# Altium schematic sheet charge_drv.SchDoc
size A2
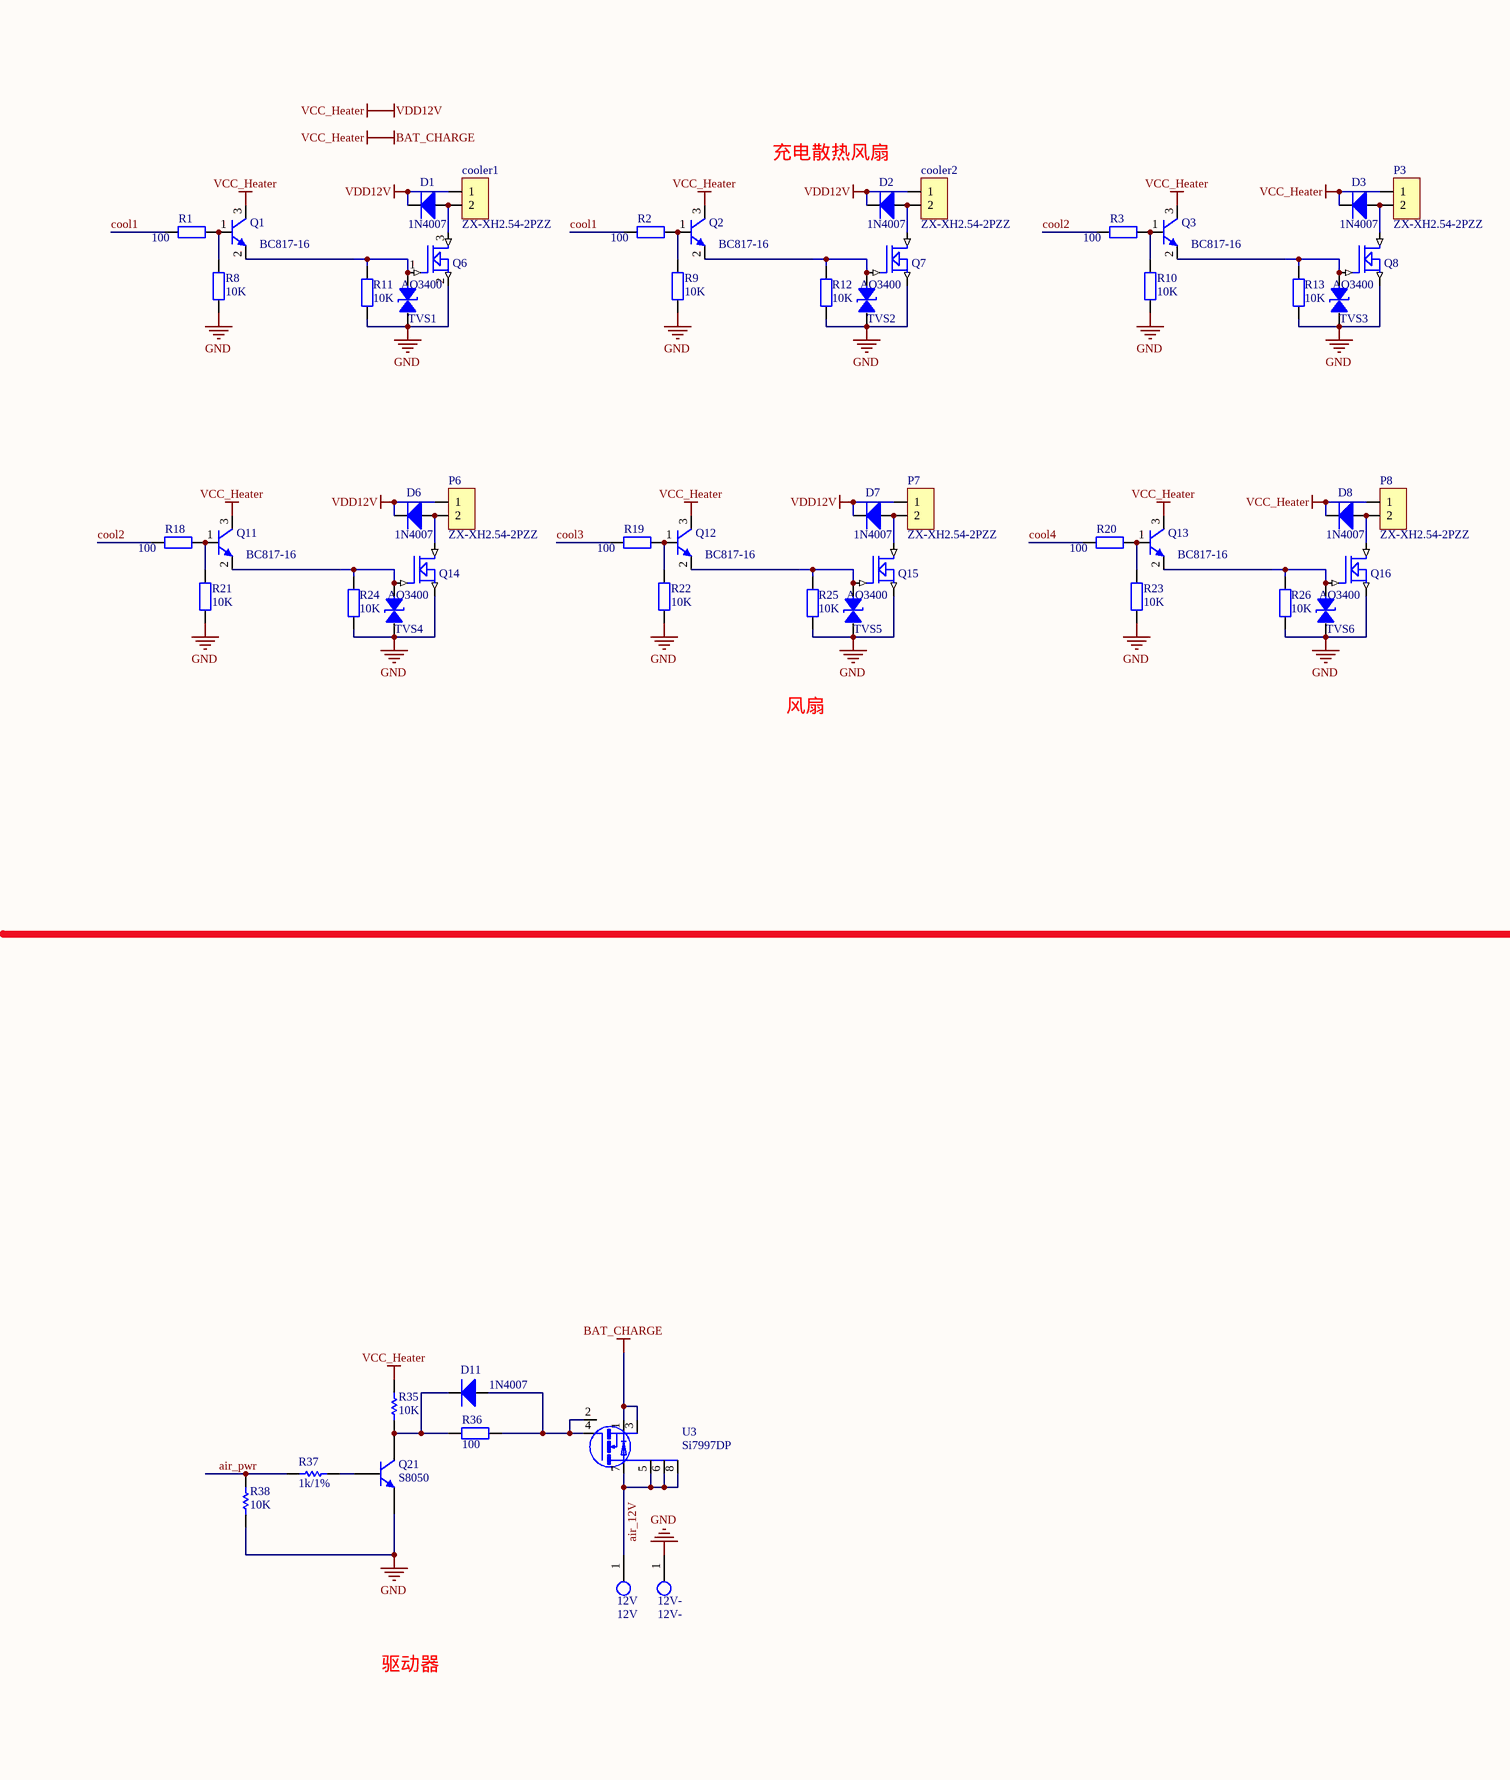
[diagram p0: charge_drv.SchDoc, left]
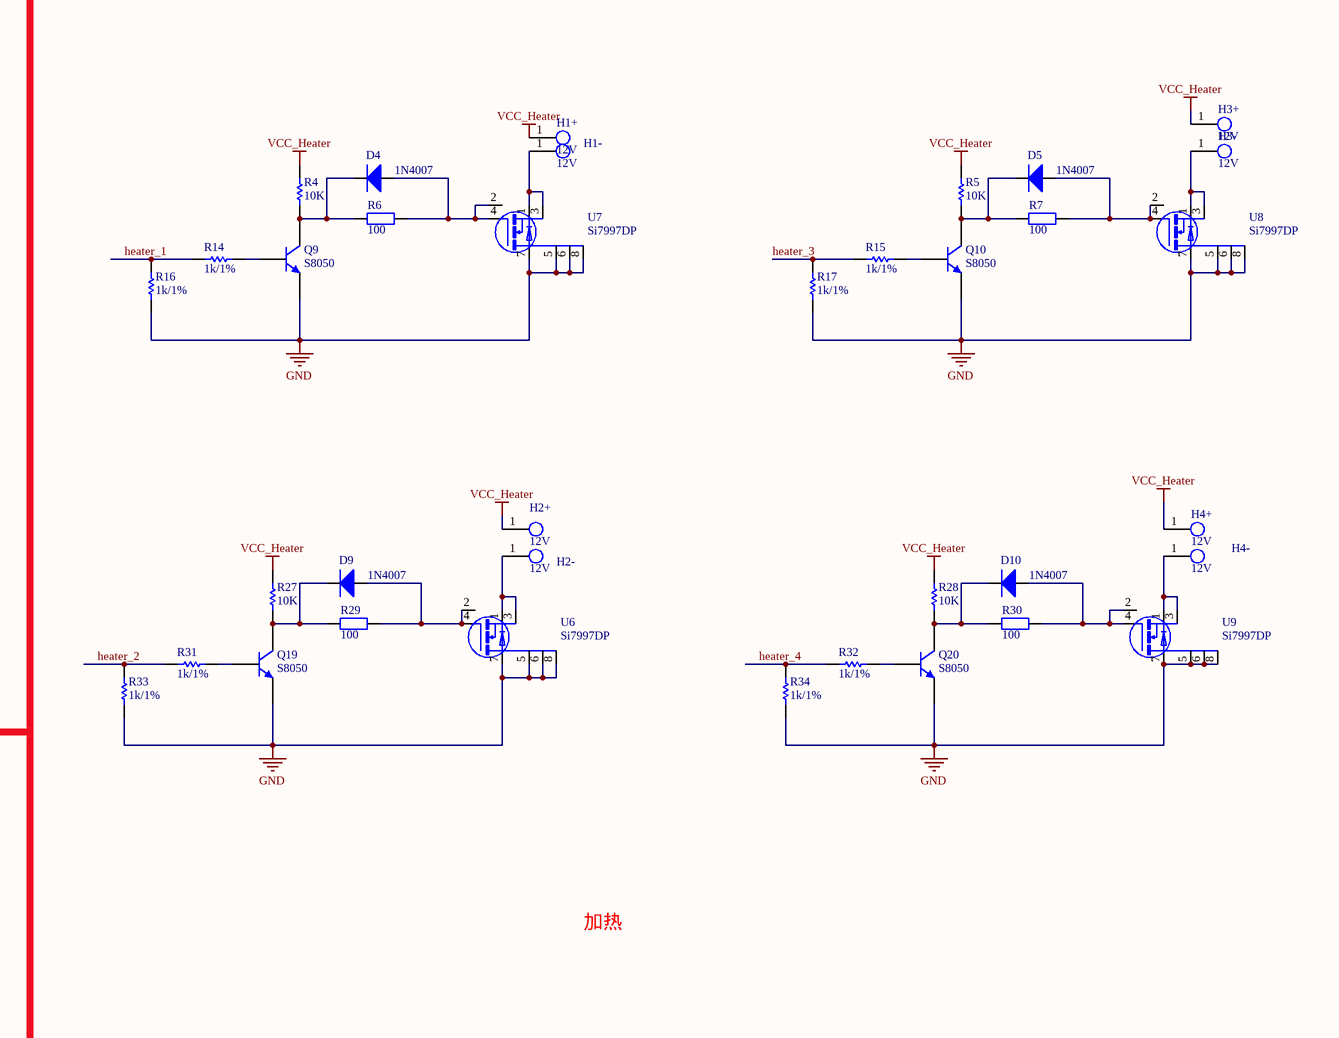
[diagram p1: charge_drv.SchDoc, right]

## Parts
12V  12V  [FIX-4.5]  (no BOM)
12V-  12V-  [FIX-4.5]  (no BOM)
cooler1  ZX-XH2.54-2PZZ  [SIP-2A]
cooler2  ZX-XH2.54-2PZZ  [SIP-2A]
D1  1N4007  [DO-214-AC]
D2  1N4007  [DO-214-AC]
D3  1N4007  [DO-214-AC]
D4  1N4007  [DO-214-AC]
D5  1N4007  [DO-214-AC]
D6  1N4007  [DO-214-AC]
D7  1N4007  [DO-214-AC]
D8  1N4007  [DO-214-AC]
D9  1N4007  [DO-214-AC]
D10  1N4007  [DO-214-AC]
D11  1N4007  [DO-214-AC]
H1+  12V  [FIX-4.5]  (no BOM)
H1-  12V  [FIX-4.5]  (no BOM)
H2+  12V  [FIX-4.5]  (no BOM)
H2-  12V  [FIX-4.5]  (no BOM)
H3+  12V  [FIX-4.5]  (no BOM)
H3-  12V  [FIX-4.5]  (no BOM)
H4+  12V  [FIX-4.5]  (no BOM)
H4-  12V  [FIX-4.5]  (no BOM)
P3  ZX-XH2.54-2PZZ  [SIP-2A]
P6  ZX-XH2.54-2PZZ  [SIP-2A]
P7  ZX-XH2.54-2PZZ  [SIP-2A]
P8  ZX-XH2.54-2PZZ  [SIP-2A]
Q1  BC817-16  [SOT23-3]
Q2  BC817-16  [SOT23-3]
Q3  BC817-16  [SOT23-3]
Q6  AO3400  [SOT23-3]
Q7  AO3400  [SOT23-3]
Q8  AO3400  [SOT23-3]
Q9  S8050  [SOT23-3]
Q10  S8050  [SOT23-3]
Q11  BC817-16  [SOT23-3]
Q12  BC817-16  [SOT23-3]
Q13  BC817-16  [SOT23-3]
Q14  AO3400  [SOT23-3]
Q15  AO3400  [SOT23-3]
Q16  AO3400  [SOT23-3]
Q19  S8050  [SOT23-3]
Q20  S8050  [SOT23-3]
Q21  S8050  [SOT23-3]
R1  100  [0603R]
R2  100  [0603R]
R3  100  [0603R]
R4  10K  [0603R]
R5  10K  [0603R]
R6  100  [0603R]
R7  100  [0603R]
R8  10K  [0603R]
R9  10K  [0603R]
R10  10K  [0603R]
R11  10K  [0603R]
R12  10K  [0603R]
R13  10K  [0603R]
R14  1k/1%  [0603R]
R15  1k/1%  [0603R]
R16  1k/1%  [0603R]
R17  1k/1%  [0603R]
R18  100  [0603R]
R19  100  [0603R]
R20  100  [0603R]
R21  10K  [0603R]
R22  10K  [0603R]
R23  10K  [0603R]
R24  10K  [0603R]
R25  10K  [0603R]
R26  10K  [0603R]
R27  10K  [0603R]
R28  10K  [0603R]
R29  100  [0603R]
R30  100  [0603R]
R31  1k/1%  [0603R]
R32  1k/1%  [0603R]
R33  1k/1%  [0603R]
R34  1k/1%  [0603R]
R35  10K  [0603R]
R36  100  [0603R]
R37  1k/1%  [0603R]
R38  10K  [0603R]
TVS1  ESD5Z5.0CT1G  [SOD-523]  (value not drawn)
TVS2  ESD5Z5.0CT1G  [SOD-523]  (value not drawn)
TVS3  ESD5Z5.0CT1G  [SOD-523]  (value not drawn)
TVS4  ESD5Z5.0CT1G  [SOD-523]  (value not drawn)
TVS5  ESD5Z5.0CT1G  [SOD-523]  (value not drawn)
TVS6  ESD5Z5.0CT1G  [SOD-523]  (value not drawn)
U3  Si7997DP  [PowerPAK SO-8]
U6  Si7997DP  [PowerPAK SO-8]
U7  Si7997DP  [PowerPAK SO-8]
U8  Si7997DP  [PowerPAK SO-8]
U9  Si7997DP  [PowerPAK SO-8]

## Nets
BAT_CHARGE: cooler1.1 cooler2.1 D1.2(K) D2.2(K) D3.2(K) D6.2(K) D7.2(K) D8.2(K) H1+.1 H2+.1 H3+.1 H4+.1 P3.1 P6.1 P7.1 P8.1 Q1.3(C) Q2.3(C) Q3.3(C) Q11.3(C) Q12.3(C) Q13.3(C) R4.2 R5.2 R27.2 R28.2 R35.2 U3.1(S) U3.3(S)  [also labelled VCC_Heater, VDD12V]
GND: 12V-.1 Q6.2(S) Q7.2(S) Q8.2(S) Q9.2(E) Q10.2(E) Q14.2(S) Q15.2(S) Q16.2(S) Q19.2(E) Q20.2(E) Q21.2(E) R8.1 R9.1 R10.1 R11.2 R12.2 R13.2 R16.2 R17.2 R21.1 R22.1 R23.1 R24.2 R25.2 R26.2 R33.2 R34.2 R38.2 TVS1.1(A) TVS2.1(A) TVS3.1(A) TVS4.1(A) TVS5.1(A) TVS6.1(A) U6.5(D) U6.6(D) U6.7(D) U6.8(D) U7.5(D) U7.6(D) U7.7(D) U7.8(D) U8.5(D) U8.6(D) U8.7(D) U8.8(D) U9.5(D) U9.6(D) U9.7(D) U9.8(D)
air_12V: 12V.1 U3.5(D) U3.6(D) U3.7(D) U3.8(D)
air_pwr: R37.2 R38.1
cool1: R1.2 R2.2
cool2: R3.2 R18.2
cool3: R19.2
cool4: R20.2
heater_1: R14.2 R16.1
heater_2: R31.2 R33.1
heater_3: R15.2 R17.1
heater_4: R32.2 R34.1
Netcooler1_2: cooler1.2 D1.1(A) Q6.3(D)
Netcooler2_2: cooler2.2 D2.1(A) Q7.3(D)
NetD3_1: D3.1(A) P3.2 Q8.3(D)
NetD4_1: D4.1(A) R6.2 U7.2(G) U7.4(G)
NetD4_2: D4.2(K) Q9.3(C) R4.1 R6.1
NetD5_1: D5.1(A) R7.2 U8.2(G) U8.4(G)
NetD5_2: D5.2(K) Q10.3(C) R5.1 R7.1
NetD6_1: D6.1(A) P6.2 Q14.3(D)
NetD7_1: D7.1(A) P7.2 Q15.3(D)
NetD8_1: D8.1(A) P8.2 Q16.3(D)
NetD9_1: D9.1(A) R29.2 U6.2(G) U6.4(G)
NetD9_2: D9.2(K) Q19.3(C) R27.1 R29.1
NetD10_1: D10.1(A) R30.2 U9.2(G) U9.4(G)
NetD10_2: D10.2(K) Q20.3(C) R28.1 R30.1
NetD11_1: D11.1(A) R36.2 U3.2(G) U3.4(G)
NetD11_2: D11.2(K) Q21.3(C) R35.1 R36.1
NetH1-_1: H1-.1 U7.1(S) U7.3(S)
NetH2-_1: H2-.1 U6.1(S) U6.3(S)
NetH3-_1: H3-.1 U8.1(S) U8.3(S)
NetH4-_1: H4-.1 U9.1(S) U9.3(S)
NetQ1_1: Q1.1(B) R1.1 R8.2
NetQ1_2: Q1.2(E) Q6.1(G) R11.1 TVS1.2(B)
NetQ2_1: Q2.1(B) R2.1 R9.2
NetQ2_2: Q2.2(E) Q7.1(G) R12.1 TVS2.2(B)
NetQ3_1: Q3.1(B) R3.1 R10.2
NetQ3_2: Q3.2(E) Q8.1(G) R13.1 TVS3.2(B)
NetQ9_1: Q9.1(B) R14.1
NetQ10_1: Q10.1(B) R15.1
NetQ11_1: Q11.1(B) R18.1 R21.2
NetQ11_2: Q11.2(E) Q14.1(G) R24.1 TVS4.2(B)
NetQ12_1: Q12.1(B) R19.1 R22.2
NetQ12_2: Q12.2(E) Q15.1(G) R25.1 TVS5.2(B)
NetQ13_1: Q13.1(B) R20.1 R23.2
NetQ13_2: Q13.2(E) Q16.1(G) R26.1 TVS6.2(B)
NetQ19_1: Q19.1(B) R31.1
NetQ20_1: Q20.1(B) R32.1
NetQ21_1: Q21.1(B) R37.1

## Notes on the sheet
- 充电散热风扇
- 风扇
- 加热
- 驱动器

## Library data of the parts
12V 12V- H1+ H1- H2+ H2- H3+ H3- H4+ H4- = TP
cooler1 cooler2 P3 P6-P8 = SIP-2: XH2.54 2P 立贴
D1-D11 = DIODE2: 贴片二极管
Q1-Q3 Q11-Q13 = NPN-1: 三极管
Q6-Q8 Q14-Q16 = MOSFET N
Q9 Q10 Q19-Q21 = NPN: NPN Bipolar Transistor; Published: 8-Jun-2000; LatestRevisionDate: 17-Jul-2002; LatestRevisionNote: Re-released for DXP Platform.; PackageReference: TO-226; Publisher: Altium Limited; Code_JEDEC: TO-226-AA
R1-R3 R6-R13 R18-R26 R29 R30 R36 = RES-SOP: 贴片电阻 5%
R4 R5 R14-R17 R27 R28 R31-R35 R37 R38 = Res1: Resistor; Published: 8-Jun-2000; LatestRevisionDate: 17-Jul-2002; LatestRevisionNote: Re-released for DXP Platform.; PackageReference: AXIAL-0.3; Publisher: Altium Limited
TVS1-TVS6 = TVS-1: TVS
U3 U6-U9 = Si7997DP: Sia430DJ